# Altium project HexapodRobot_STC15W4K48S4.PrjPcb
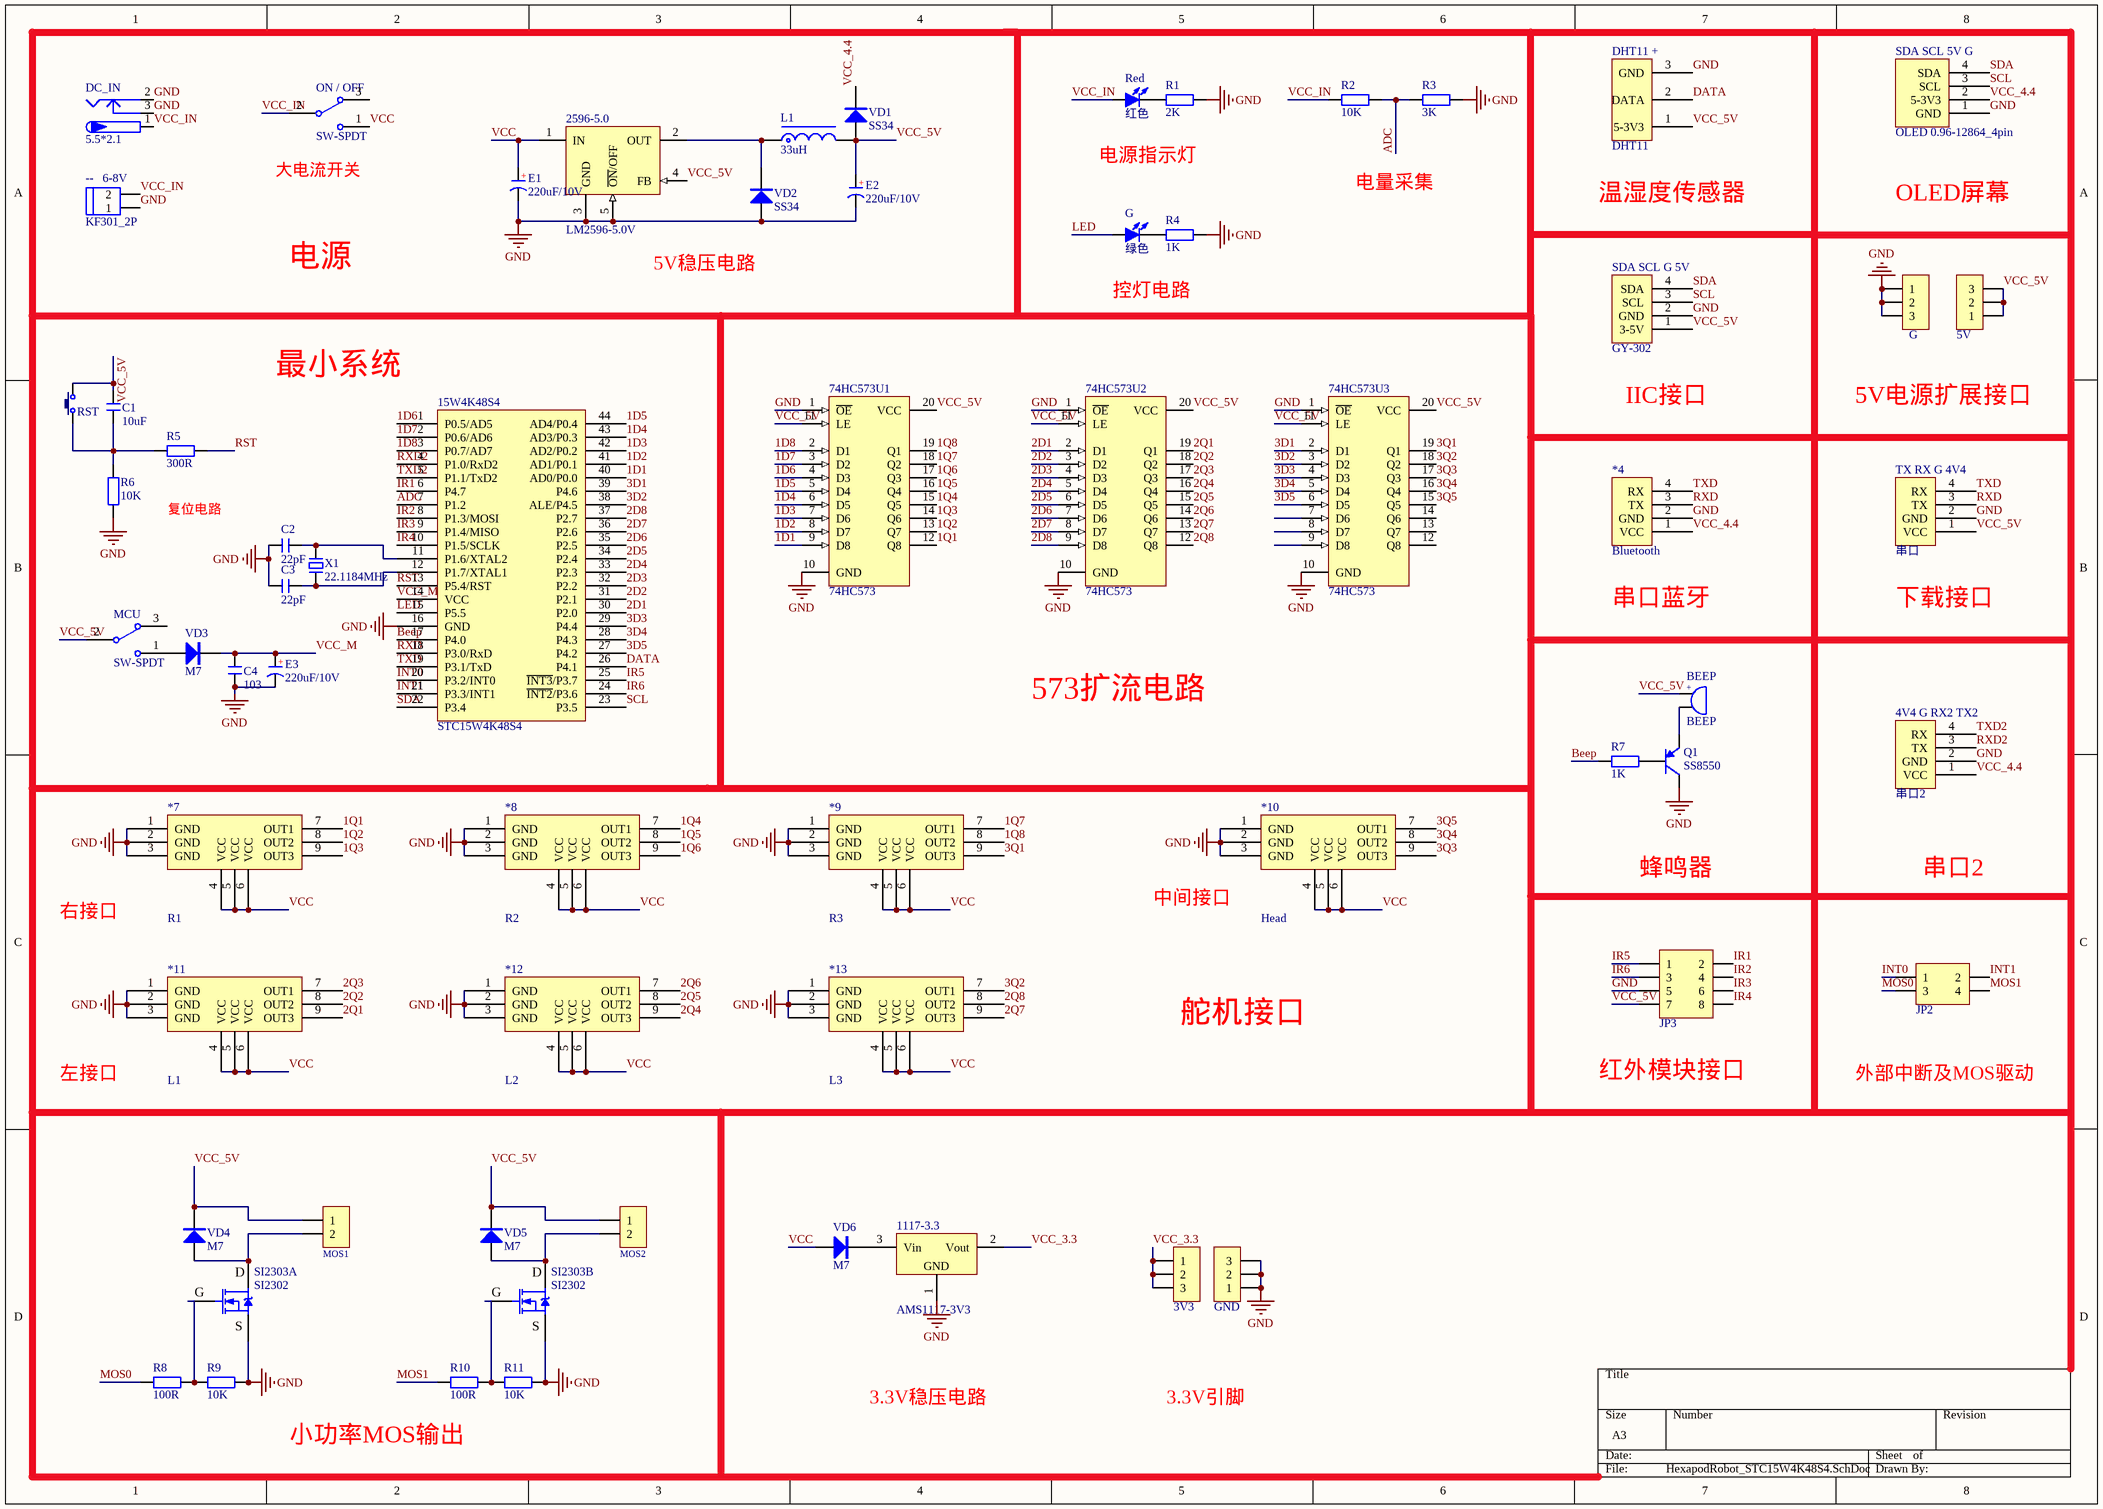
[diagram p0: HexapodRobot_STC15W4K48S4.SchDoc]
1 sheet, 64 parts. Net scope: global (net labels, ports and power ports of the same name join across sheets).
Board file: HexapodRobot_STC15W4K48S4.PcbDoc

## Sheet HexapodRobot_STC15W4K48S4.SchDoc
size A3

### Parts
(Parts that share a designator on the sheet are numbered #1, #2 ... from top to bottom, then left to right.)
3V3  HDR-1X3  [HDR-1X3R]  (value not drawn)
4V4_G_RX2_TX2  串口2  [HDR-1X4_M]
5V  HDR-1X3  [HDR-1X3R]  (value not drawn)
15W4K48S4  STC15W4K48S4  [LQFP44 10X10_L]
74HC573U1  74HC573  [TSSOP20_N]
74HC573U2  74HC573  [TSSOP20_N]
74HC573U3  74HC573  [TSSOP20_N]
1117-3.3  AMS1117-3V3  [SOT223_L]
2596-5.0  LM2596-5.0V  [TO263-5A]
*4  Bluetooth  [HDR-1X4_M]
*7  R1  [heard3X3]
*8  R2  [heard3X3]
*9  R3  [heard3X3]
*10  Head  [heard3X3]
*11  L1  [HEARD3X3-]
*12  L2  [HEARD3X3-]
*13  L3  [HEARD3X3-]
--_6-8V  KF301_2P  [KF301-2P]
BEEP  BEEP  [BEEP 5x9x5.5]
C1  10uF  [C 0603]
C2  22pF  [C 0603]
C3  22pF  [C 0603]
C4  103  [C 0603]
DC_IN  5.5*2.1  [DC-005]
DHT11_+  DHT11  [HDR-1X3_M]
E1  220uF/10V  [CT 6*6 - C]
E2  220uF/10V  [CT 6*6 - C]
E3  220uF/10V  [CT 6*6 - C]
G#1  绿色  [LED 0603G]
G#2  HDR-1X3  [HDR-1X3]  (value not drawn)
GND  HDR-1X3  [HDR-1X3]  (value not drawn)
JP2  Header2X2  [HDR-2X2]  (value not drawn)
JP3  Header 4X2  [HDR-4X2]  (value not drawn)
L1  33uH  [CDRH127]
MCU  SW-SPDT  [KEY_HDR3]
MOS1  HDR-1X2  [HDR-1X2]  (value not drawn)
MOS2  HDR-1X2  [HDR-1X2]  (value not drawn)
ON_/_OFF  SW-SPDT  [纽子开关]
Q1  SS8550  [TO92A]
R1  2K  [R 0603]
R2  10K  [R 0603]
R3  3K  [R 0603]
R4  1K  [R 0603]
R5  300R  [R 0603]
R6  10K  [R 0603]
R7  1K  [R 0603]
R8  100R  [R 0603]
R9  10K  [R 0603]
R10  100R  [R 0603]
R11  10K  [R 0603]
Red  红色  [LED 0603R]
RST  3x6x5  [TSW SMD-3*6*2.5]  (value not drawn)
SDA_SCL_5V_G  OLED 0.96-12864_4pin  [OLED 0.96-12864_4pin]
SDA_SCL_G_5V  GY-302  [HDR-1X4]
SI2303A  SI2302  [SOT23-3N]
SI2303B  SI2302  [SOT23-3N]
TX_RX_G_4V4  串口  [HDR-1X4_M]
VD1  SS34  [SMC]
VD2  SS34  [SMC]
VD3  M7  [SMA]
VD4  M7  [SMA]
VD5  M7  [SMA]
VD6  M7  [SMA]
X1  22.1184MHz  [XTAL-49S DIP]

### Nets
GND: 4V4_G_RX2_TX2.2(GND) 15W4K48S4.16(GND) 74HC573U1.1(~{OE}) 74HC573U1.10(GND) 74HC573U2.1(~{OE}) 74HC573U2.10(GND) 74HC573U3.1(~{OE}) 74HC573U3.10(GND) 1117-3.3.1(GND) 2596-5.0.3(GND) 2596-5.0.5(~{ON}/OFF) *4.2(GND) *7.1(GND) *7.2(GND) *7.3(GND) *8.1(GND) *8.2(GND) *8.3(GND) *9.1(GND) *9.2(GND) *9.3(GND) *10.1(GND) *10.2(GND) *10.3(GND) *11.1(GND) *11.2(GND) *11.3(GND) *12.1(GND) *12.2(GND) *12.3(GND) *13.1(GND) *13.2(GND) *13.3(GND) --_6-8V.1 C2.1 C3.1 C4.1 DC_IN.2 DC_IN.3 DHT11_+.3(GND) E1.2(K) E2.2(K) E3.2(K) G#2.1 G#2.2 G#2.3 GND.1 GND.2 GND.3 JP3.5 Q1.3(C) R1.2 R3.2 R4.2 R6.1 R9.2 R11.2 SDA_SCL_5V_G.1(GND) SDA_SCL_G_5V.2(GND) SI2303A.2(S) SI2303B.2(S) TX_RX_G_4V4.2(GND) VD2.1(A)
1D1: 15W4K48S4.40(AD0/P0.0) 74HC573U1.9(D8)
1D2: 15W4K48S4.41(AD1/P0.1) 74HC573U1.8(D7)
1D3: 15W4K48S4.42(AD2/P0.2) 74HC573U1.7(D6)
1D4: 15W4K48S4.43(AD3/P0.3) 74HC573U1.6(D5)
1D5: 15W4K48S4.44(AD4/P0.4) 74HC573U1.5(D4)
1D6: 15W4K48S4.1(P0.5/AD5) 74HC573U1.4(D3)
1D7: 15W4K48S4.2(P0.6/AD6) 74HC573U1.3(D2)
1D8: 15W4K48S4.3(P0.7/AD7) 74HC573U1.2(D1)
1Q1: 74HC573U1.12(Q8) *7.7(OUT1)
1Q2: 74HC573U1.13(Q7) *7.8(OUT2)
1Q3: 74HC573U1.14(Q6) *7.9(OUT3)
1Q4: 74HC573U1.15(Q5) *8.7(OUT1)
1Q5: 74HC573U1.16(Q4) *8.8(OUT2)
1Q6: 74HC573U1.17(Q3) *8.9(OUT3)
1Q7: 74HC573U1.18(Q2) *9.7(OUT1)
1Q8: 74HC573U1.19(Q1) *9.8(OUT2)
2D1: 15W4K48S4.30(P2.0) 74HC573U2.2(D1)
2D2: 15W4K48S4.31(P2.1) 74HC573U2.3(D2)
2D3: 15W4K48S4.32(P2.2) 74HC573U2.4(D3)
2D4: 15W4K48S4.33(P2.3) 74HC573U2.5(D4)
2D5: 15W4K48S4.34(P2.4) 74HC573U2.6(D5)
2D6: 15W4K48S4.35(P2.5) 74HC573U2.7(D6)
2D7: 15W4K48S4.36(P2.6) 74HC573U2.8(D7)
2D8: 15W4K48S4.37(P2.7) 74HC573U2.9(D8)
2Q1: 74HC573U2.19(Q1) *11.9(OUT3)
2Q2: 74HC573U2.18(Q2) *11.8(OUT2)
2Q3: 74HC573U2.17(Q3) *11.7(OUT1)
2Q4: 74HC573U2.16(Q4) *12.9(OUT3)
2Q5: 74HC573U2.15(Q5) *12.8(OUT2)
2Q6: 74HC573U2.14(Q6) *12.7(OUT1)
2Q7: 74HC573U2.13(Q7) *13.9(OUT3)
2Q8: 74HC573U2.12(Q8) *13.8(OUT2)
3D1: 15W4K48S4.39(P4.6) 74HC573U3.2(D1)
3D2: 15W4K48S4.38(ALE/P4.5) 74HC573U3.3(D2)
3D3: 15W4K48S4.29(P4.4) 74HC573U3.4(D3)
3D4: 15W4K48S4.28(P4.3) 74HC573U3.5(D4)
3D5: 15W4K48S4.27(P4.2) 74HC573U3.6(D5)
3Q1: 74HC573U3.19(Q1) *9.9(OUT3)
3Q2: 74HC573U3.18(Q2) *13.7(OUT1)
3Q3: 74HC573U3.17(Q3) *10.9(OUT3)
3Q4: 74HC573U3.16(Q4) *10.8(OUT2)
3Q5: 74HC573U3.15(Q5) *10.7(OUT1)
ADC: 15W4K48S4.7(P1.2) R2.2 R3.1
Beep: 15W4K48S4.17(P4.0) R7.1
DATA: 15W4K48S4.26(P4.1) DHT11_+.2(DATA)
INT0: 15W4K48S4.20(P3.2/INT0) JP2.1
INT1: 15W4K48S4.21(P3.3/INT1) JP2.2
IR1: 15W4K48S4.6(P4.7) JP3.2
IR2: 15W4K48S4.8(P1.3/MOSI) JP3.4
IR3: 15W4K48S4.9(P1.4/MISO) JP3.6
IR4: 15W4K48S4.10(P1.5/SCLK) JP3.8
IR5: 15W4K48S4.25(~{INT3}/P3.7) JP3.1
IR6: 15W4K48S4.24(~{INT2}/P3.6) JP3.3
LED: 15W4K48S4.15(P5.5) G#1.1(A)
MOS0: JP2.3 R8.1
MOS1: JP2.4 R10.1
RST: 15W4K48S4.13(P5.4/RST) R5.1
RXD: 15W4K48S4.18(P3.0/RxD) *4.3(TX) TX_RX_G_4V4.3(TX)
RXD2: 4V4_G_RX2_TX2.3(TX) 15W4K48S4.4(P1.0/RxD2)
SCL: 15W4K48S4.23(P3.5) SDA_SCL_5V_G.3(SCL) SDA_SCL_G_5V.3(SCL)
SDA: 15W4K48S4.22(P3.4) SDA_SCL_5V_G.4(SDA) SDA_SCL_G_5V.4(SDA)
TXD: 15W4K48S4.19(P3.1/TxD) *4.4(RX) TX_RX_G_4V4.4(RX)
TXD2: 4V4_G_RX2_TX2.4(RX) 15W4K48S4.5(P1.1/TxD2)
VCC: 2596-5.0.1(IN) *7.4(VCC) *7.5(VCC) *7.6(VCC) *8.4(VCC) *8.5(VCC) *8.6(VCC) *9.4(VCC) *9.5(VCC) *9.6(VCC) *10.4(VCC) *10.5(VCC) *10.6(VCC) *11.4(VCC) *11.5(VCC) *11.6(VCC) *12.4(VCC) *12.5(VCC) *12.6(VCC) *13.4(VCC) *13.5(VCC) *13.6(VCC) E1.1(A) ON_/_OFF.1 VD6.1(A)
VCC_3.3: 3V3.1 3V3.2 3V3.3 1117-3.3.2(Vout)
VCC_4.4: 4V4_G_RX2_TX2.1(VCC) *4.1(VCC) SDA_SCL_5V_G.2(5-3V3) VD1.2(K)
VCC_5V: 5V.1 5V.2 5V.3 74HC573U1.11(LE) 74HC573U1.20(VCC) 74HC573U2.11(LE) 74HC573U2.20(VCC) 74HC573U3.11(LE) 74HC573U3.20(VCC) 2596-5.0.4(FB) BEEP.1 C1.2 DHT11_+.1(5-3V3) E2.1(A) JP3.7 L1.2 MCU.2 MOS1.1 MOS2.1 RST.2 SDA_SCL_G_5V.1(3-5V) TX_RX_G_4V4.1(VCC) VD1.1(A) VD4.2(K) VD5.2(K)
VCC_IN: --_6-8V.2 DC_IN.1 ON_/_OFF.2 R2.1 Red.1(A)
VCC_M: 15W4K48S4.14(VCC) C4.2 E3.1(A) VD3.2(K)
Net15W4K48S4_11: 15W4K48S4.11(P1.6/XTAL2) C2.2 X1.2
Net15W4K48S4_12: 15W4K48S4.12(P1.7/XTAL1) C3.2 X1.1
Net1117-3.3_3: 1117-3.3.3(Vin) VD6.2(K)
Net2596-5.0_2: 2596-5.0.2(OUT) L1.1 VD2.2(K)
NetBEEP_2: BEEP.2 Q1.1(E)
NetC1_1: C1.1 R5.2 R6.2 RST.1
NetG#1_2: G#1.2(K) R4.1
NetMCU_1: MCU.1 VD3.1(A)
NetMOS1_2: MOS1.2 SI2303A.3(D) VD4.1(A)
NetMOS2_2: MOS2.2 SI2303B.3(D) VD5.1(A)
NetQ1_2: Q1.2(B) R7.2
NetR1_1: R1.1 Red.2(K)
NetR8_2: R8.2 R9.1 SI2303A.1(G)
NetR10_2: R10.2 R11.1 SI2303B.1(G)

Not connected (* = marked no-connect by the designer): 74HC573U3 7(D6) 8(D7) 9(D8) 12(Q8) 13(Q7) 14(Q6); MCU 3; ON_/_OFF 3

### Notes on the sheet
- (near ON_/_OFF) 大电流开关
- 电源指示灯
- 电量采集
- 温湿度传感器
- OLED屏幕
- 电源
- 5V稳压电路
- 控灯电路
- 最小系统
- IIC接口
- 5V电源扩展接口
- 复位电路
- 串口蓝牙
- 下载接口
- 573扩流电路
- 右接口
- 中间接口
- 蜂鸣器
- 串口2
- 舵机接口
- 左接口
- 红外模块接口
- 外部中断及MOS驱动
- 小功率MOS输出
- 3.3V稳压电路
- 3.3V引脚
- (in symbol BEEP) +
- (in symbol C-CT) +

### Library data of the parts
3V3 5V G#2 GND = Header 3: 3P接插件; 版权归属: 源创客; BOM名称: 3P接插件; 学习资源: www.ooocke.com
4V4_G_RX2_TX2 *4 TX_RX_G_4V4 = Header4booth: 蓝牙/串口
15W4K48S4 = STC15F2K60S2-44pin: STC单片机; 版权归属: 源创客; BOM名称: STC单片机; 学习资源: www.ooocke.com
74HC573U1-74HC573U3 = 74HC573: D类三态输出锁存器; 版权归属: 源创客; BOM名称: 三态输出锁存器; 学习资源: www.ooocke.com
1117-3.3 = AMS1117: 三端稳压芯片; BOM名称: 稳压芯片; 版权归属: 源创客; 学习资源: www.ooocke.com
2596-5.0 = LM2596: DC降压芯片; BOM名称: DC稳压芯片; 版权归属: 源创客; 学习资源: www.ooocke.com
*7-*13 = hader_3*3
--_6-8V = HEAD2: KF301
BEEP = BEEP: 蜂鸣器; 版权归属: 源创客; BOM名称: 蜂鸣器; 学习资源: www.ooocke.com
C1-C4 = C: 无极性贴片电容; 版权归属: 源创客; BOM名称: 无极性贴片电容; 学习资源: www.ooocke.com
DC_IN = P-DC: 低压电源接口; BOM名称: DC电源接口; 版权归属: 源创客; 学习资源: www.ooocke.com
E1-E3 = C-CT: 贴片固态电容; 版权归属: 源创客; BOM名称: 贴片固态电容; 学习资源: www.ooocke.com
G#1 Red = LED-SMD: 贴片LED; 版权归属: 源创客; BOM名称: 贴片LED; 学习资源: www.ooocke.com
JP2 = Header 2X2: 2*2P接插件; 版权归属: 源创客; BOM名称: 2*2P接插件; 学习资源: www.ooocke.com
JP3 = Header 4X2: 4*2P接插件; 版权归属: 源创客; BOM名称: 4*2P接插件; 学习资源: www.ooocke.com
L1 = L-CDRH: 功率屏蔽电感; 版权归属: 源创客; BOM名称: 功率屏蔽电感; 学习资源: www.ooocke.com
MCU ON_/_OFF = SW-SPDT: 开关; Published: 24-Mar-1999; LatestRevisionDate: 17-Dec-2003; LatestRevisionNote: Schematic revised, PCB Footprint replaced.; DatasheetDocument: 05-Dec-2000; PackageReference: TL36WW15050; Publisher: Altium Limited; ComponentLink1Description: Manufacturer Link; ComponentLink1URL: http://www.apem.com
MOS1 MOS2 = Header 2: 2P接插件; 版权归属: 源创客; BOM名称: 2P接插件; 学习资源: www.ooocke.com
Q1 = 8550-DIP: 高频放大-PNP型; 版权归属: 源创客; 属性: 40V 1.5A 1W 100MHZ; BOM名称: 高频放大-PNP型; 学习资源: www.ooocke.com
R1-R11 = R: 贴片电阻; 版权归属: 源创客; BOM名称: 贴片电阻; 学习资源: www.ooocke.com
RST = TSW 3x6: 3x6轻触开关; 版权归属: 源创客; BOM名称: 3x6轻触开关; 学习资源: www.ooocke.com
SDA_SCL_5V_G = OLED 0.96-12864_4pin: 12864 点阵屏
SI2303A SI2303B = SI2302: N沟道场效应管; 版权归属: 源创客; BOM名称: N沟道场效应管; 学习资源: www.ooocke.com
VD1 VD2 = SS34: 肖特基二极管; 版权归属: 源创客; 属性: 40V/3A; BOM名称: 肖特基二极管; 学习资源: www.ooocke.com
VD3-VD6 = M7: 整流二极管; 版权归属: 源创客; BOM名称: 整流二极管; 学习资源: www.ooocke.com
X1 = XTAL-2: 2脚晶振; 版权归属: 源创客; BOM名称: 2脚晶振; 学习资源: www.ooocke.com